# EAGLE design QFN-16_with_EP_to_DIP-17 (EAGLE 8.5.1)
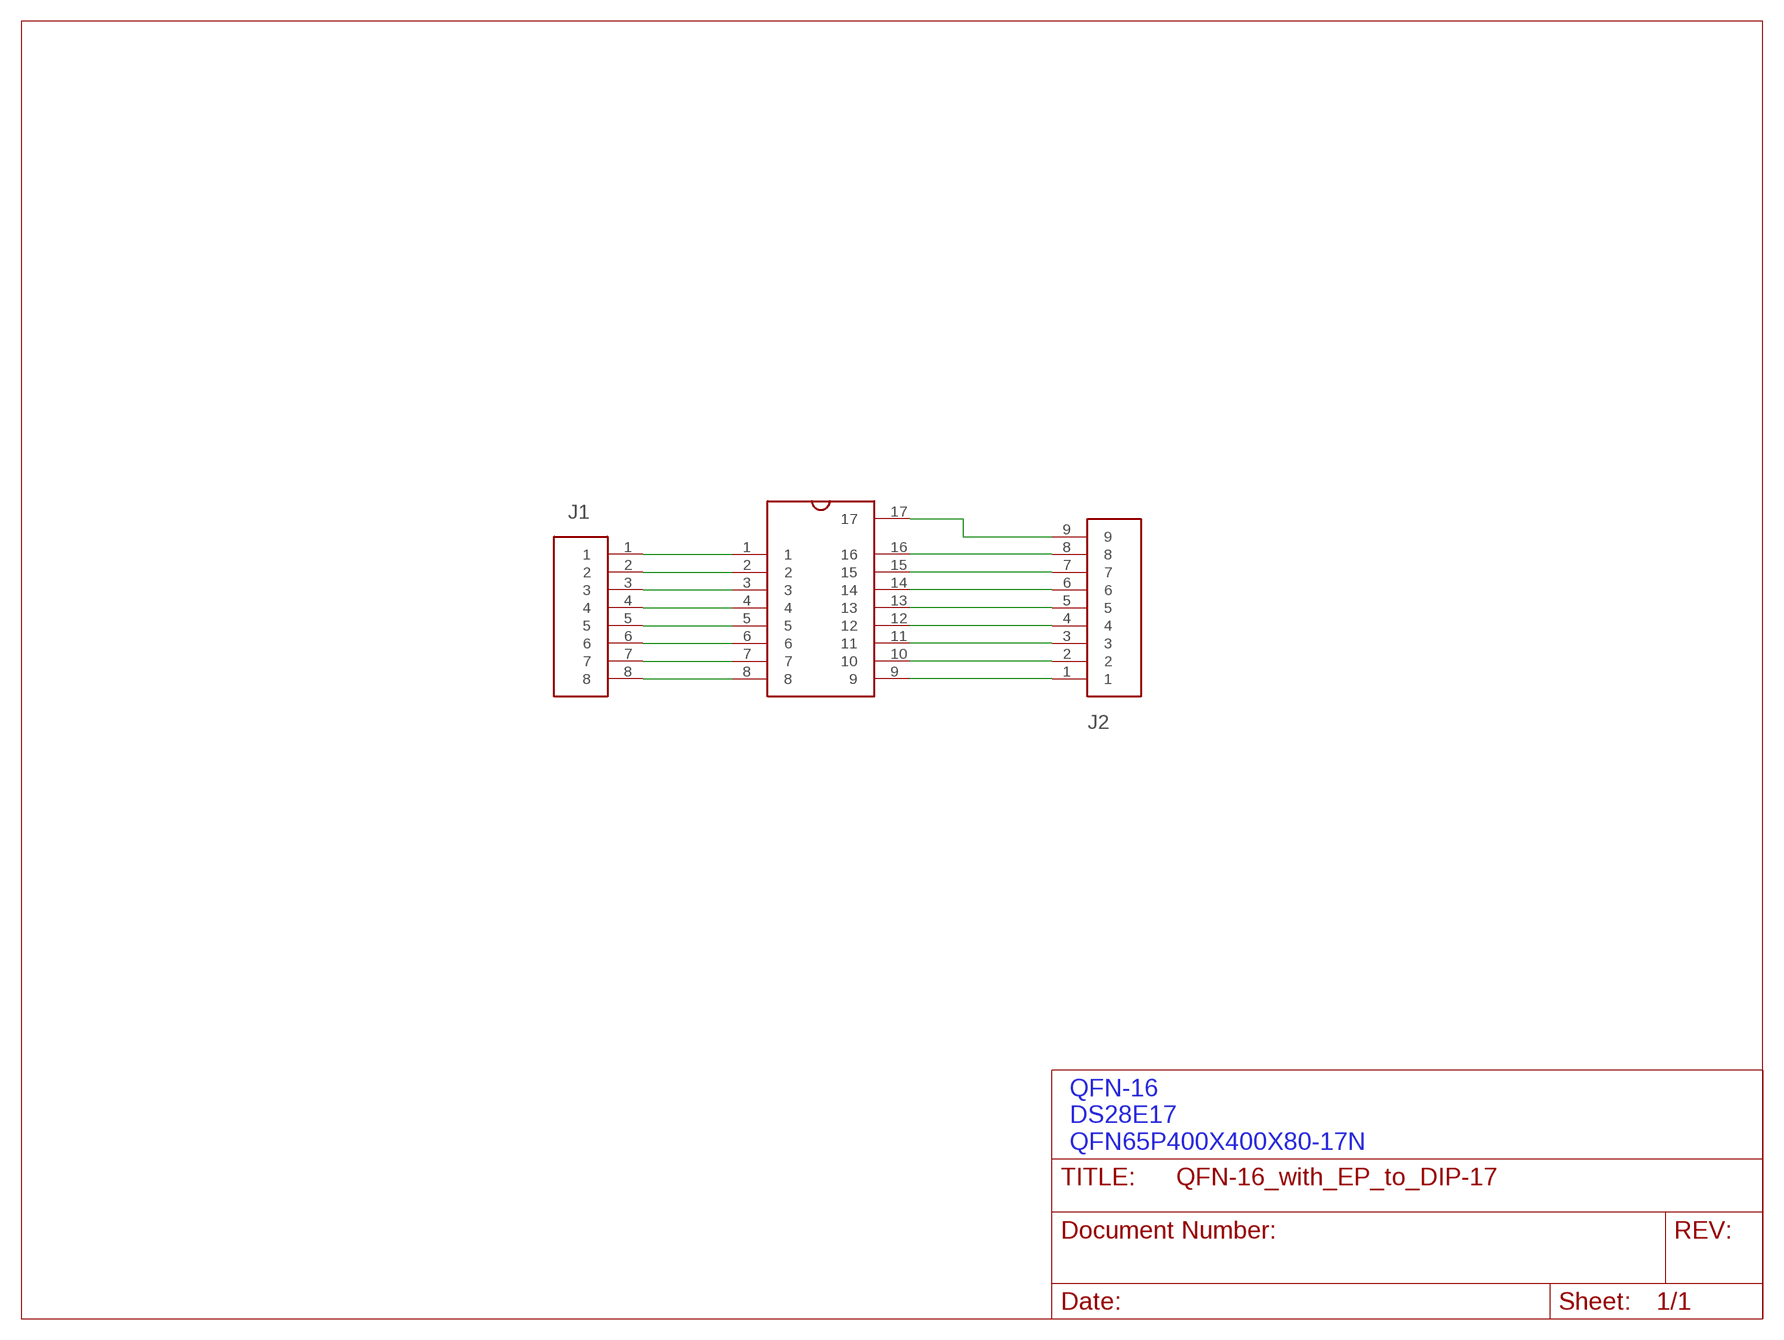
[diagram p0: schematic, sheet 1]

## Parts
J1  CONNECTOR_8  [68000-108HLF]
J2  CONNECTOR_9  [68000-109HLF-NO-SQUARE]
U1  QFN-16_WITH_EP-QFN-16_EP  [QFN65P400X400X80-17N]

## Nets
N$1: J1.1 U1.1
N$2: J1.2 U1.2
N$3: J1.3 U1.3
N$4: J1.4 U1.4
N$5: J1.5 U1.5
N$6: J1.6 U1.6
N$7: J1.7 U1.7
N$8: J1.8 U1.8
N$9: J2.1 U1.9
N$10: J2.2 U1.10
N$11: J2.3 U1.11
N$12: J2.4 U1.12
N$13: J2.5 U1.13
N$14: J2.6 U1.14
N$15: J2.7 U1.15
N$16: J2.8 U1.16
N$17: J2.9 U1.17

## Notes on the sheet
- QFN-16
  DS28E17
  QFN65P400X400X80-17N

## Library data of the parts
J1 = SnapEDA:CONNECTOR_8
J2 = SnapEDA:CONNECTOR_9
U1 = SnapEDA:QFN-16_WITH_EP

## Board
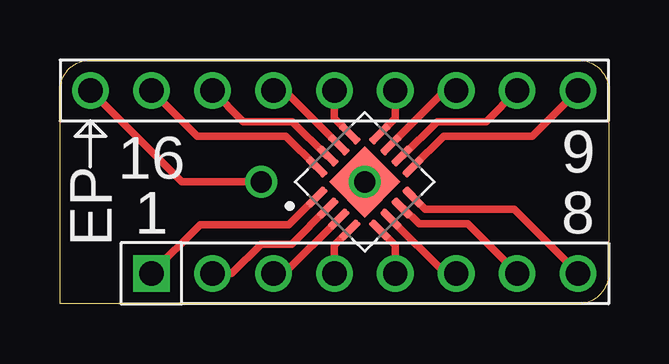
[diagram p1: board, top side]
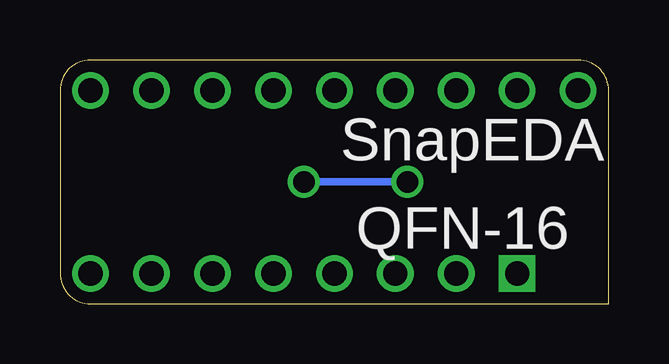
[diagram p2: board, bottom side, seen from below]

Size 22.86 x 10.16 mm. Coordinates in mm from the lower left corner, seen from the top.
Outline: 0,0 0,8.89 arc-90 1.27,10.16 21.59,10.16 arc-90 22.86,8.89 22.86,1.27 arc-90 21.59,0 0,0
Copper layers (1*16): Top 0.035559375mm / dielectric 1.6mm / Bottom 0.035559375mm
Design rules "oshpark-2layer *": minimum track width 6mil, minimum drill 10mil, track to track 12mil, track to pad 12mil, pad to pad 6mil, via to via 6mil, smd to smd 6mil, copper to edge 15mil, drill to drill 6mil, minimum pad ring 5mil, minimum via ring 5mil, stop-mask expansion 2.5mil, vias tented up to drill 0mil, thermal gap 10mil

### Footprints (pad centres in the part's own frame; a part is rotated, then mirrored left to right if it is on the bottom)
68000-108HLF = drill 1.016 square: 1 0,0 | drill 1.016: 2 2.54,0; 3 5.08,0; 4 7.62,0; 5 10.16,0; 6 12.7,0; 7 15.24,0; 8 17.78,0
68000-109HLF-NO-SQUARE = drill 1.016: 1 0,0; 2 2.54,0; 3 5.08,0; 4 7.62,0; 5 10.16,0; 6 12.7,0; 7 15.24,0; 8 17.78,0; 9 20.32,0
QFN65P400X400X80-17N = smd 1.01 x 0.32: 1 -1.86,0.975; 2 -1.86,0.325; 3 -1.86,-0.325; 4 -1.86,-0.975; 9 1.86,-0.975; 10 1.86,-0.325; 11 1.86,0.325; 12 1.86,0.975 | smd 0.32 x 1.01: 5 -0.975,-1.86; 6 -0.325,-1.86; 7 0.325,-1.86; 8 0.975,-1.86; 13 0.975,1.86; 14 0.325,1.86; 15 -0.325,1.86; 16 -0.975,1.86 | smd 2.1 x 2.1: 17 0,0

### Placement (x,y rotation side)
J1  3.81,1.27 0 top
J2  21.59,8.89 180 top
U1  12.7,5.08 45 top

### Tracks (layer width: path | path; a pad name or v marks a point on that pad's centre or on a via)
N$1
  Top 0.305: U1.1 9.53,3.3 5.84,3.3 J1.1
N$2
  Top 0.305: U1.2 9.65,2.49 8.38,2.49 7.17,1.27 J1.2
N$3
  Top 0.305: U1.3 9.35,1.27 J1.3
N$4
  Top 0.305: U1.4 11.43,2.43 J1.4
N$5
  Top 0.305: U1.5 13.97,2.43 J1.5
N$6
  Top 0.305: U1.6 16.05,1.27 J1.6
N$7
  Top 0.305: U1.7 14.29,4 14.96,3.33 16.99,3.33 J1.7
N$8
  Top 0.305: U1.8 15.22,3.94 18.92,3.94 J1.8
N$9
  Top 0.305: U1.9 15.98,6.99 19.68,6.99 J2.1
N$10
  Top 0.305: U1.10 14.29,6.17 15.72,7.59 17.75,7.59 J2.2
N$11
  Top 0.305: U1.11 16.05,8.89 J2.3
N$12
  Top 0.305: U1.12 13.97,7.73 J2.4
N$13
  Top 0.305: U1.13 11.43,7.73 J2.5
N$14
  Top 0.305: U1.14 9.35,8.89 J2.6
N$15
  Top 0.305: U1.15 11.11,6.17 9.68,7.59 7.64,7.59 J2.7
N$16
  Top 0.305: U1.16 9.42,6.99 5.71,6.99 J2.8
N$17  (via drill 0.89)
  Top 0.305: J2.9 5.08,5.08 v8.38,5.08 8.51,5.08 | U1.17 12.7,6.1
  Bottom 0.305: v8.38,5.08 U1.17
  other vias: 12.7,5.08

### Text on the board
tPlace: 16 | 9 | EP | 1 | 8
bPlace: SnapEDA | QFN-16